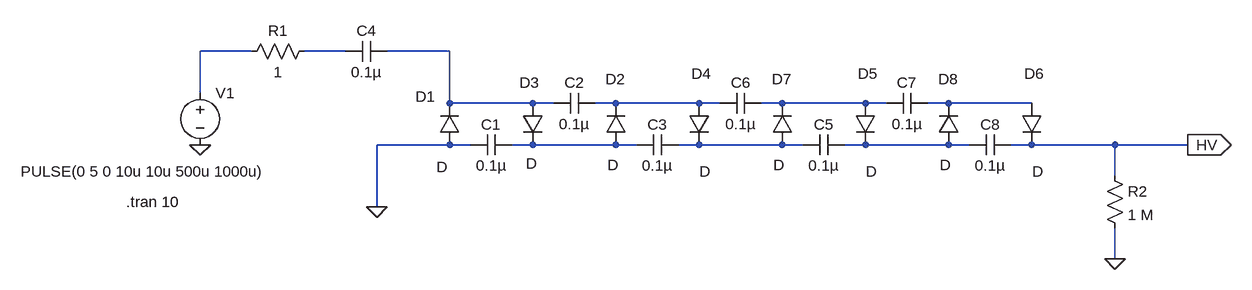
[diagram p0: schematic VoltageBuildupColumn.asc]
VoltageBuildupColumn.asc, the LTspice schematic file:
Version 4
SHEET 1 1404 680
WIRE -128 32 -208 32
WIRE 16 32 -48 32
WIRE 176 32 80 32
WIRE -208 96 -208 32
WIRE 176 112 176 32
WIRE 304 112 176 112
WIRE 336 112 304 112
WIRE 432 112 400 112
WIRE 560 112 432 112
WIRE 592 112 560 112
WIRE 688 112 656 112
WIRE 816 112 688 112
WIRE 848 112 816 112
WIRE 944 112 912 112
WIRE 1072 112 944 112
WIRE 176 176 64 176
WIRE 208 176 176 176
WIRE 304 176 272 176
WIRE 432 176 304 176
WIRE 464 176 432 176
WIRE 560 176 528 176
WIRE 688 176 560 176
WIRE 720 176 688 176
WIRE 816 176 784 176
WIRE 944 176 816 176
WIRE 976 176 944 176
WIRE 1072 176 1040 176
WIRE 1200 176 1072 176
WIRE 1312 176 1200 176
WIRE 1200 224 1200 176
WIRE 64 272 64 176
WIRE 1200 352 1200 304
FLAG 64 272 0
FLAG -208 176 0
FLAG 1200 352 0
FLAG 1312 176 HV
IOPIN 1312 176 Out
SYMBOL diode 192 176 R180
WINDOW 0 38 74 Left 2
WINDOW 3 19 -34 Left 2
SYMATTR InstName D1
SYMBOL diode 448 176 R180
WINDOW 0 1 101 Left 2
WINDOW 3 12 -31 Left 2
SYMATTR InstName D2
SYMBOL diode 320 112 M0
WINDOW 0 6 -32 Left 2
WINDOW 3 9 93 Left 2
SYMATTR InstName D3
SYMBOL diode 576 112 M0
WINDOW 0 -3 -46 Left 2
WINDOW 3 -2 105 Left 2
SYMATTR InstName D4
SYMBOL cap 272 160 R90
WINDOW 0 0 32 VBottom 2
WINDOW 3 32 32 VTop 2
SYMATTR InstName C1
SYMATTR Value 0.1µ
SYMBOL cap 400 96 R90
WINDOW 0 0 32 VBottom 2
WINDOW 3 32 32 VTop 2
SYMATTR InstName C2
SYMATTR Value 0.1µ
SYMBOL cap 528 160 R90
WINDOW 0 0 32 VBottom 2
WINDOW 3 32 32 VTop 2
SYMATTR InstName C3
SYMATTR Value 0.1µ
SYMBOL cap 80 16 R90
WINDOW 0 0 32 VBottom 2
WINDOW 3 32 32 VTop 2
SYMATTR InstName C4
SYMATTR Value 0.1µ
SYMBOL voltage -208 80 R0
WINDOW 3 -276 137 Left 2
WINDOW 123 0 0 Left 0
WINDOW 39 0 0 Left 0
SYMATTR InstName V1
SYMATTR Value PULSE(0 5 0 10u 10u 500u 1000u)
SYMBOL res -32 16 R90
WINDOW 0 0 56 VBottom 2
WINDOW 3 32 56 VTop 2
SYMATTR InstName R1
SYMATTR Value 1
SYMBOL diode 832 112 M0
WINDOW 0 -3 -46 Left 2
WINDOW 3 -2 105 Left 2
SYMATTR InstName D5
SYMBOL diode 1088 112 M0
WINDOW 0 -3 -46 Left 2
WINDOW 3 -2 105 Left 2
SYMATTR InstName D6
SYMBOL diode 704 176 R180
WINDOW 0 1 101 Left 2
WINDOW 3 12 -31 Left 2
SYMATTR InstName D7
SYMBOL diode 960 176 R180
WINDOW 0 1 101 Left 2
WINDOW 3 12 -31 Left 2
SYMATTR InstName D8
SYMBOL cap 784 160 R90
WINDOW 0 0 32 VBottom 2
WINDOW 3 32 32 VTop 2
SYMATTR InstName C5
SYMATTR Value 0.1µ
SYMBOL cap 656 96 R90
WINDOW 0 0 32 VBottom 2
WINDOW 3 32 32 VTop 2
SYMATTR InstName C6
SYMATTR Value 0.1µ
SYMBOL cap 912 96 R90
WINDOW 0 0 32 VBottom 2
WINDOW 3 32 32 VTop 2
SYMATTR InstName C7
SYMATTR Value 0.1µ
SYMBOL cap 1040 160 R90
WINDOW 0 0 32 VBottom 2
WINDOW 3 32 32 VTop 2
SYMATTR InstName C8
SYMATTR Value 0.1µ
SYMBOL res 1184 208 R0
SYMATTR InstName R2
SYMATTR Value 1 M
TEXT -322 264 Left 2 !.tran 10

The netlist it stands for:
* VoltageBuildupColumn.asc
D1 0 N003 D
D2 N007 N004 D
D3 N003 N007 D
D4 N004 N008 D
C1 N007 0 0.1µ
C2 N004 N003 0.1µ
C3 N008 N007 0.1µ
C4 N003 N002 0.1µ
V1 N001 0 PULSE(0 5 0 10u 10u 500u 1000u)
R1 N002 N001 1
D5 N005 N009 D
D6 N006 HV D
D7 N008 N005 D
D8 N009 N006 D
C5 N009 N008 0.1µ
C6 N005 N004 0.1µ
C7 N006 N005 0.1µ
C8 HV N009 0.1µ
R2 HV 0 1 M
.model D D
.lib standard.dio
.tran 10
.backanno
.end